# Altium schematic sheet Sheet2.SchDoc
size A3; SheetNumber: 3; SheetTotal: 3
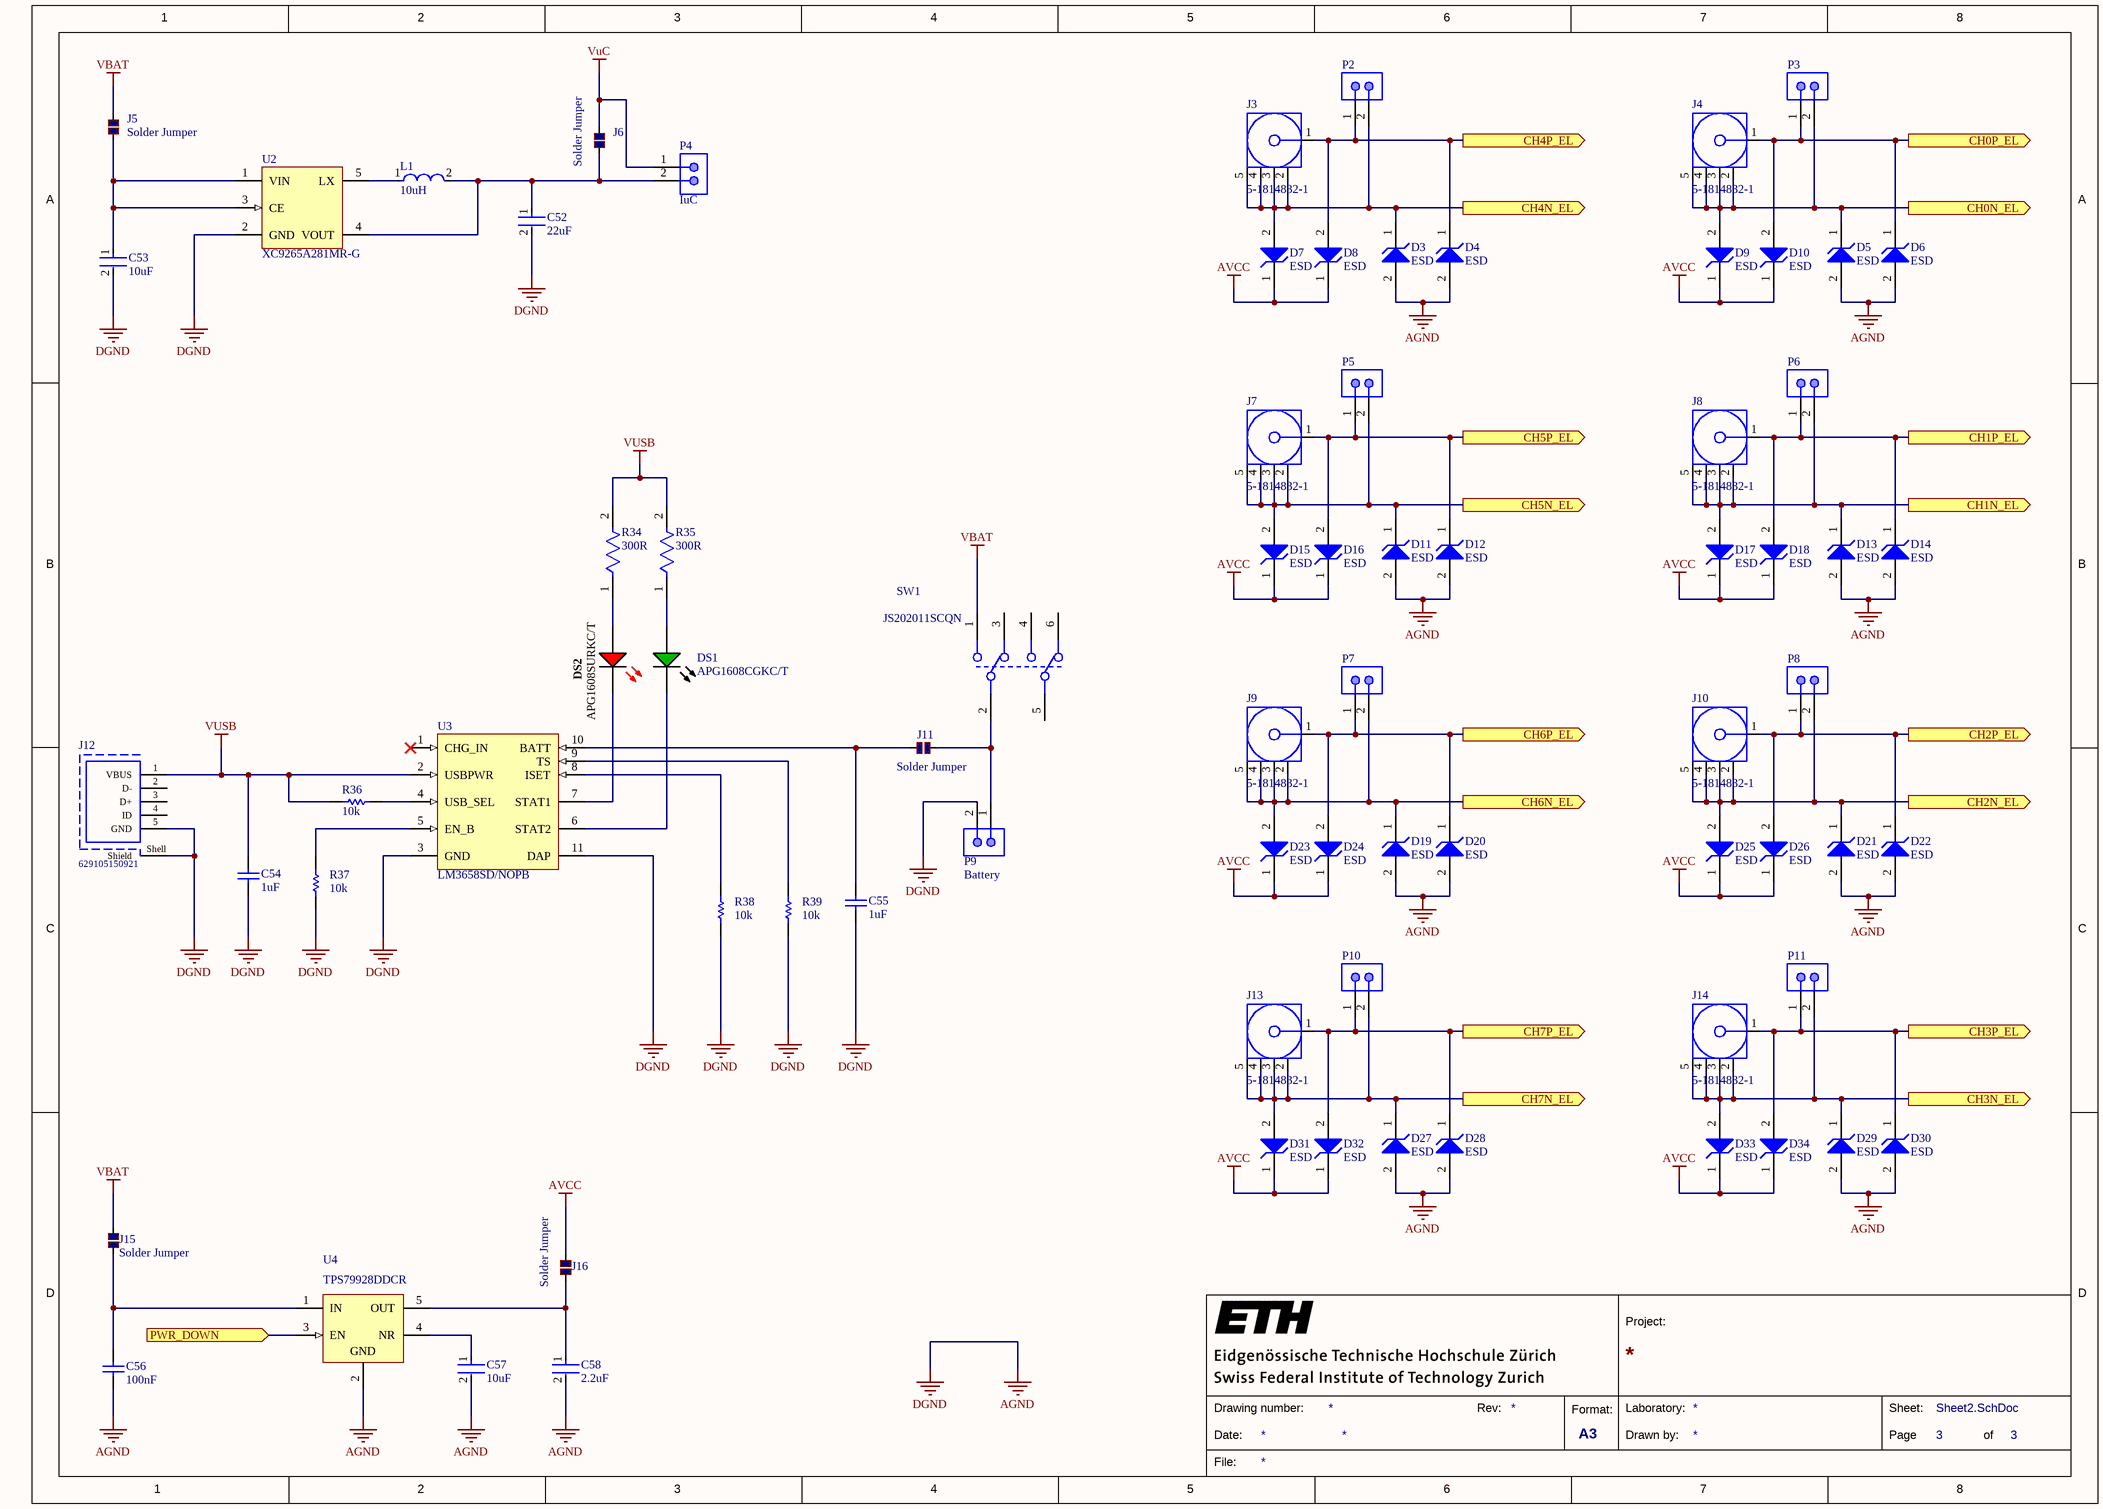
[diagram p0: Sheet2.SchDoc]

## Parts
C52  22uF  [FP-CL10-IPC_A]
C53  10uF  [FP-GRM188-0_1-e0_2_0_55-IPC_B]
C54  1uF  [CAPC1608X95X40ML15T15]
C55  1uF  [CAPC1608X95X40ML15T15]
C56  100nF  [CAPC1608X92X38LL15T08]
C57  10uF  [FP-GRM188-0_1-e0_2_0_55-IPC_B]
C58  2.2uF  [FP-GRM188-0_1-e0_2_0_5-IPC_C]
D3  ESD  [DFN110P160X55-2N]
D4  ESD  [DFN110P160X55-2N]
D5  ESD  [DFN110P160X55-2N]
D6  ESD  [DFN110P160X55-2N]
D7  ESD  [DFN110P160X55-2N]
D8  ESD  [DFN110P160X55-2N]
D9  ESD  [DFN110P160X55-2N]
D10  ESD  [DFN110P160X55-2N]
D11  ESD  [DFN110P160X55-2N]
D12  ESD  [DFN110P160X55-2N]
D13  ESD  [DFN110P160X55-2N]
D14  ESD  [DFN110P160X55-2N]
D15  ESD  [DFN110P160X55-2N]
D16  ESD  [DFN110P160X55-2N]
D17  ESD  [DFN110P160X55-2N]
D18  ESD  [DFN110P160X55-2N]
D19  ESD  [DFN110P160X55-2N]
D20  ESD  [DFN110P160X55-2N]
D21  ESD  [DFN110P160X55-2N]
D22  ESD  [DFN110P160X55-2N]
D23  ESD  [DFN110P160X55-2N]
D24  ESD  [DFN110P160X55-2N]
D25  ESD  [DFN110P160X55-2N]
D26  ESD  [DFN110P160X55-2N]
D27  ESD  [DFN110P160X55-2N]
D28  ESD  [DFN110P160X55-2N]
D29  ESD  [DFN110P160X55-2N]
D30  ESD  [DFN110P160X55-2N]
D31  ESD  [DFN110P160X55-2N]
D32  ESD  [DFN110P160X55-2N]
D33  ESD  [DFN110P160X55-2N]
D34  ESD  [DFN110P160X55-2N]
DS1  APG1608CGKC/T  [KING-LED0603-25-GREEN_V]
DS2  APG1608SURKC/T  [KING-LED0603-25-RED_V]
J3  5-1814832-1  [TECO-5-1814832-1_V]
J4  5-1814832-1  [TECO-5-1814832-1_V]
J5  Solder Jumper  [Small Solder Jumper]
J6  Solder Jumper  [Small Solder Jumper]
J7  5-1814832-1  [TECO-5-1814832-1_V]
J8  5-1814832-1  [TECO-5-1814832-1_V]
J9  5-1814832-1  [TECO-5-1814832-1_V]
J10  5-1814832-1  [TECO-5-1814832-1_V]
J11  Solder Jumper  [Small Solder Jumper]
J12  629105150921  [629105150921]
J13  5-1814832-1  [TECO-5-1814832-1_V]
J14  5-1814832-1  [TECO-5-1814832-1_V]
J15  Solder Jumper  [Small Solder Jumper]
J16  Solder Jumper  [Small Solder Jumper]
L1  10uH  [FP-LQH43CN_03-MFG]
P2  FIX_RLD  [SMTC-TSW-102-07-S-S]  (value not drawn)
P3  FIX_RLD  [SMTC-TSW-102-07-S-S]  (value not drawn)
P4  IuC  [SMTC-TSW-102-07-S-S]
P5  FIX_RLD  [SMTC-TSW-102-07-S-S]  (value not drawn)
P6  FIX_RLD  [SMTC-TSW-102-07-S-S]  (value not drawn)
P7  FIX_RLD  [SMTC-TSW-102-07-S-S]  (value not drawn)
P8  FIX_RLD  [SMTC-TSW-102-07-S-S]  (value not drawn)
P9  Battery  [SMTC-TSW-102-07-S-S]
P10  FIX_RLD  [SMTC-TSW-102-07-S-S]  (value not drawn)
P11  FIX_RLD  [SMTC-TSW-102-07-S-S]  (value not drawn)
R34  300R  [FP-CRCW0603-e3-IPC_A]
R35  300R  [FP-CRCW0603-e3-IPC_A]
R36  10k  [RESC1609X50X30NL8T20]
R37  10k  [RESC1609X50X30NL8T20]
R38  10k  [RESC1609X50X30NL8T20]
R39  10k  [RESC1609X50X30NL8T20]
SW1  JS202011SCQN  [FP-JS202011SCQN-MFG]
U2  XC9265A281MR-G  [Z5+1_N]
U3  LM3658SD/NOPB  [DSC0010A_V]
U4  TPS79928DDCR  [DDC0005A_L]

## Ports
CH0N_EL (out), CH0P_EL (out), CH1N_EL (out), CH1P_EL (out), CH2N_EL (out), CH2P_EL (out), CH3N_EL (out), CH3P_EL (out), CH4N_EL (out), CH4P_EL (out), CH5N_EL (out), CH5P_EL (out), CH6N_EL (out), CH6P_EL (out), CH7N_EL (out), CH7P_EL (out), PWR_DOWN (in)

## Nets
AGND: C52.2 C53.2 C54.1 C55.1 C56.2 C57.2 C58.2 D3.2 D4.2 D5.2 D6.2 D11.2 D12.2 D13.2 D14.2 D19.2 D20.2 D21.2 D22.2 D27.2 D28.2 D29.2 D30.2 J12.5(GND) J12.Shell(Shield) P9.2 R37.1 R38.1 R39.1 U2.2(GND) U3.3(GND) U3.11(DAP) U4.2(GND)  [also labelled DGND]
AVCC: D7.1 D8.1 D9.1 D10.1 D15.1 D16.1 D17.1 D18.1 D23.1 D24.1 D25.1 D26.1 D31.1 D32.1 D33.1 D34.1 J16.2
VBAT: J5.1 J15.2 SW1.1
VuC: J6.1 P4.1
VUSB: C54.2 J12.1(VBUS) R34.2 R35.2 R36.2 U3.2(USBPWR)
CH0N_EL: D5.1 D9.2 J4.2 J4.3 J4.4 J4.5 P3.2 ; port CH0N_EL
CH0P_EL: D6.1 D10.2 J4.1 P3.1 ; port CH0P_EL
CH1N_EL: D13.1 D17.2 J8.2 J8.3 J8.4 J8.5 P6.2 ; port CH1N_EL
CH1P_EL: D14.1 D18.2 J8.1 P6.1 ; port CH1P_EL
CH2N_EL: D21.1 D25.2 J10.2 J10.3 J10.4 J10.5 P8.2 ; port CH2N_EL
CH2P_EL: D22.1 D26.2 J10.1 P8.1 ; port CH2P_EL
CH3N_EL: D29.1 D33.2 J14.2 J14.3 J14.4 J14.5 P11.2 ; port CH3N_EL
CH3P_EL: D30.1 D34.2 J14.1 P11.1 ; port CH3P_EL
CH4N_EL: D3.1 D7.2 J3.2 J3.3 J3.4 J3.5 P2.2 ; port CH4N_EL
CH4P_EL: D4.1 D8.2 J3.1 P2.1 ; port CH4P_EL
CH5N_EL: D11.1 D15.2 J7.2 J7.3 J7.4 J7.5 P5.2 ; port CH5N_EL
CH5P_EL: D12.1 D16.2 J7.1 P5.1 ; port CH5P_EL
CH6N_EL: D19.1 D23.2 J9.2 J9.3 J9.4 J9.5 P7.2 ; port CH6N_EL
CH6P_EL: D20.1 D24.2 J9.1 P7.1 ; port CH6P_EL
CH7N_EL: D27.1 D31.2 J13.2 J13.3 J13.4 J13.5 P10.2 ; port CH7N_EL
CH7P_EL: D28.1 D32.2 J13.1 P10.1 ; port CH7P_EL
PWR_DOWN: U4.3(EN) ; port PWR_DOWN
NetC52_1: C52.1 J6.2 L1.2 P4.2 U2.4(VOUT)
NetC53_1: C53.1 J5.2 U2.1(VIN) U2.3(CE)
NetC55_2: C55.2 J11.2 U3.10(BATT)
NetC56_1: C56.1 J15.1 U4.1(IN)
NetC57_1: C57.1 U4.4(NR)
NetC58_1: C58.1 J16.1 U4.5(OUT)
NetDS1_1: DS1.1(A) R35.1
NetDS1_2: DS1.2(K) U3.6(STAT2)
NetDS2_1: DS2.1(A) R34.1
NetDS2_2: DS2.2(K) U3.7(STAT1)
NetJ11_1: J11.1 P9.1 SW1.2
NetL1_1: L1.1 U2.5(LX)
NetR36_1: R36.1 U3.4(USB_SEL)
NetR37_2: R37.2 U3.5(EN_B)
NetR38_2: R38.2 U3.8(ISET)
NetR39_2: R39.2 U3.9(TS)

Not connected (* = marked no-connect by the designer): J12 2(D-) 3(D+) 4(ID); SW1 3 4 5 6; U3 1(CHG_IN)*

## Notes on the sheet
- 1
- 2
- 3
- 4
- 5
- 6
- 7
- 8
- A
- B
- C
- D
- Project:
- Date:
- Drawing number:
- Rev:
- Format:
- A3
- Drawn by:
- Laboratory:
- Page
- Sheet:
- of
- File:

## Library data of the parts
C52 = CMP-13271-003053-1: Cap Ceramic 22uF 6.3V X5R ±20% Pad SMD 0603 +85°C T/R; Max Operating Temperature: 85°C; Case Code (Imperial): 0603; Packaging: Tape and Reel; Min Operating Temperature: -55°C; Voltage Rating: 6.3V; Case Code (Metric): 1608; Length: 0.063inch; Thickness: 0.041inch; Capacitance: 22uF; Tolerance: 20%; Width: 0.031inch; Mount: Surface Mount; Case/Package: 0603
C53 C57 = CMP-2006-02787-5: Chip Multilayer Ceramic Capacitors for General Purpose, 0603, 10uF, X5R, 15%, 20%, 4V; Case/Package: 0603; Thickness: 0.035inch; Mount: Surface Mount; Capacitance: 10uF; Package Quantity: 4000; Tolerance: 20%; Depth: 0.8mm; Voltage: 4V; Height: 0.8mm; Length: 1.6mm; Packaging: Tape and Reel; Case Code (Imperial): 0603; Voltage Rating: 4V; Radiation Hardening: No; Dielectric: X5R; Max Operating Temperature: 85°C; Voltage Rating (DC): 4V; Min Operating Temperature: -55°C; Termination: SMD/SMT; Width: 0.8mm; Case Code (Metric): 1608; Lead Free: Lead Free
C54 C55 = CMP-1035-02735-2: Manufacturer: Vitramon; Part Number: VJ0603V105ZXQCW1BC
C56 = CMP-1035-02583-2: Manufacturer: Vitramon; Part Number: VJ0603Y104JXJAC
C58 = CMP-2006-02548-2: Chip Multilayer Ceramic Capacitors for General Purpose, 0603, 2.2uF, X5R, 15%, 10%, 35V; REACH SVHC: No SVHC; Weight: 0.000222oz; Thickness: 0.035inch; Height: 0.8mm; Voltage Rating: 35V; Lead Free: Lead Free; Mount: Surface Mount; Material: Ceramic; Package Quantity: 4000; Capacitance: 2.2uF; Length: 1.6mm; Packaging: Tape and Reel; Case/Package: 0603; Min Operating Temperature: -55°C; Case Code (Metric): 1608; Voltage: 35V; Tolerance: 10%; Max Operating Temperature: 85°C; Depth: 0.8mm; Width: 0.8mm; Case Code (Imperial): 0603; Voltage Rating (DC): 35V; Termination: SMD/SMT; Dielectric: X5R
D3-D34 = CMP-01186-1: TVS DIODE 5V 10.9V 2DFN; Power Line Protection: No; Number of Unidirectional Channels: 1; Peak Pulse Current: 70A; Min Operating Temperature: -40°C; Reverse Standoff Voltage: 5V; Case Code (Imperial): 0603; Case Code (Metric): 1610; Clamping Voltage: 10.9V; Packaging: Tape and Reel; Composition: Zener; Max Operating Temperature: 125°C; Case/Package: 0603; Mount: Surface Mount
DS1 = CMP-0239-00001-1: LED, SMT, 0603(1608), 0.25mm Thickness, Green; Forward Current: 30 mA; Reverse Voltage: 5 V; Power Dissipation: 78 mW; Packing: Reel; ComponentLink1Description: Manufacturer URL; ComponentLink1URL: http://www.kingbrightusa.com/; ComponentLink2URL: http://www.kingbrightusa.com/images/catalog/SPEC/APG1608CGKC-T.pdf; Mounting Technology: Surface Mount; Storage Temperature: -40 to 85 degC; DatasheetVersion: Rev. 5B, 10/2012; PartNumber: APG1608CGKC/T; PackageReference: LED0603-25-GREEN; ComponentLink2Description: Datasheet; PackageDescription: 2-Pin SMT LED, 1.6 x 0.8 mm Body, 0.25mm Thickness; PackageVersion: Rev. 5B, 10/2012
DS2 = CMP-0404-00004-1: Ultra Thin Hyper Red SMD Chip LED Lamp, 2 to 2.5 V, -40 to 85 degC, Body 1.6 x 0.8 mm, 0.28 mm Thickness, RoHS, Tape and Reel; Manufacturer: Kingbright; Dice: Hyper Red (AlGaInP); IR (Max): 10 uA; Luminous Intensity mcd @ 20 mA (Min.): 55; Lens Type: Water Clear; Viewing Angle: 120; Luminous Intensity mcd @ 20 mA (Typ.): 110; ComponentLink2Description: Datasheet; ComponentLink3URL: http://www.kingbrightusa.com/images/catalog/SPEC/APG1608SURKC-T.pdf; Packing: Tape and Reel; Mounting Technology: Surface Mount; PackageVersion: Rev. V.5A; ComponentLink1Description: Manufacturer URL; ComponentLink2URL: http://www.kingbrightusa.com/images/catalog/SPEC/APG1608SURKC-T.pdf; ComponentLink3Description: Package Specification; PackageDescription: 2-Pin SMT, Body 1.6 x 0.8 mm, 0.28mm Thickness, Red; PackageReference: LED0603-25-RED; DatasheetVersion: Rev. V.5A; Operating Temperature: -40 to 85 degC; PartNumber: APG1608SURKC/T; ComponentLink1URL: http://www.kingbrightusa.com/; Forward Voltage: 2 to 2.5 V; RoHS: TRUE
J3 J4 J7-J10 J13 J14 = CMP-2000-05415-1: SMA Connector, Pitch 5.08 mm, 1 Position, Height 9.5 mm, Tail Length 4 mm, -65 to 165 degC, RoHS, Bulk; Manufacturer: TE Connectivity; Connector Mounting: PCBMount; Connector Body Style: StraightJack; Impedance: 50ohm; Coaxial Termination: Solder; SVHC: NoSVHC(15-Jun-2015); Frequency Max: 3GHz; Product Range: ZDCSeries; Connector Type: SMACoaxial; Datasheet Version: Rev. B1, 03/2011; Package Reference: 5-1814832-1; Package Description: SMA Connector, Pitch 5.08 mm, 1 Position, Height 9.5 mm, Tail Length 4 mm; Contact Plating: GoldPlatedContacts; Coaxial Cable Types: -; Contact Material: BerylliumCopper; Manufacturer URL: http://www.te.com/; Datasheet URL: http://www.onlinecomponents.com/productFiles/mf-AMP/eng_cd_1814832_a.pdf
J5 J6 J11 J15 J16 = CMP-00005-5: Value: 1; Technology: SMT
J12 = CMP-1502-03249-1: Micro USB 2.0 Type AB Receptacle WR-COM, Horizontal, SMT; Manufacturer: Wurth Elektronik; Rated Current: 1.8A; Contact Resistance: 30mOhm; Working Voltage: 30VAC; Publisher: WurthElektronik; Part Number: 629105150921; Operating Temperature: -40to85degC; Gender: Receptacle; Packaging: TapeandReel; Connector Type: MicroUSB2.0TypeAB; Datasheet URL: https://katalog.we-online.de/em/datasheet/629105150921.pdf; Mounting Technology: SMT; Orientation: Horizontal; Package Reference: 629105150921; Manufacturer URL: http://www.we-online.de
L1 = CMP-06042-001365-1: Wire Wound Ferrite Inductor for Power Lines 10μH ±20% 0.1764Ω 1170mA 1812; Test Frequency: 1MHz; Shielding: Shielded; DC Resistance (DCR): 147mR; Current Rating: 1.17A; Self Resonant Frequency: 20MHz; Saturation Current: 1.05A; Height - Seated (Max): 0.11inch; Case Code (Imperial): 1812; Packaging: Cut Tape; Package Quantity: 500; Mount: Surface Mount; Resistor Type: Wirewound; Depth: 3.2mm; Inductance: 10uH; Min Operating Temperature: -40°C; Core Material: Ferrite; Lead Free: Lead Free; Tolerance: 20%; Height: 2.6mm; Length: 0.177inch; Case Code (Metric): 4532; Max DC Current: 1.17A; Case/Package: 1812; Width: 0.126inch; Max Operating Temperature: 85°C; REACH SVHC: No SVHC; Inductance Tolerance: 20%
P2-P11 = CMP-1681-00004-4: Male Header, Pitch 2.54 mm, 1 x 2 Position, Height 8.38 mm, Tail Length 2.54 mm, -55 to 125 degC, RoHS, Bulk; Manufacturer: Samtec; Rows: 1; ComponentLink1URL: http://www.samtec.com/; Contact Finish: Gold; Mounting Technology: Through Hole; PackageReference: TSW-102-07-S-S; RoHSCompliant: true; Pins: 2; Contact Material: Bronze; ComponentLink2Description: Datasheet; Max Operating Temperature: 125 degC; Min Operating Temperature: -55 degC; Height: 8.38 mm; Packaging: Bulk; ComponentLink1Description: Manufacturer URL; PackageDescription: Male Header, Pitch 2.54 mm, 1 x 2 Position, Height 8.38 mm, Tail Length 2.54 mm; Colour: Black; Contact Plating: Gold; Length: 5.08 mm; ComponentLink2URL: http://suddendocs.samtec.com/catalog_english/tsw_th.pdf; DatasheetVersion: 12/2015; Mount: Through Hole; Lead Pitch: 0.1 inch; REACH SVHC: No SVHC; Package Quantity: 1
R34 R35 = CMP-2000-03216-2: RES Thick Film, 300Ω, 1%, 0.1W, 100ppm/°C, 0603; Voltage Rating (DC): 75V; Power Rating: 100mW; Length: 1.55mm; Height: 0.45mm; Case/Package: 0603; Temperature Coefficient: 100ppm/°C; Packaging: Tape and Reel; Termination: SMD/SMT; Depth: 0.85mm; Max Operating Temperature: 155°C; Radiation Hardening: No; Tolerance: 1%; Lead Free: Lead Free; Case Code (Metric): 1608; Voltage Rating: 75V; Weight: 7.1E-05oz; Package Quantity: 10; Military Standard: Not; Case Code (Imperial): 0603; Resistance: 300R; Composition: Thick Film; Min Operating Temperature: -55°C; Width: 0.033inch; Number of Terminations: 2; Mount: Surface Mount; Features: Automotive AEC-Q200; Contact Plating: Tin; Max Power Dissipation: 100mW
R36-R39 = CMP-1666-00005-4: Chip Resistor, 10 KOhm, +/- 1%, 100 mW, -55 to 155 degC, 0603 (1608 Metric), RoHS, Tape and Reel; Manufacturer: Vishay Semiconductor; Voltage Rating: 75 V; Max Operating Temperature: 155 degC; PackageDescription: 2-Pin Surface Mount Device, Body 1.575 x 0.85 mm; ComponentLink1Description: Manufacturer URL; RoHSCompliant: true; PackageReference: 0603; REACH SVHC: Unknown; Length: 1.55 mm; DatasheetVersion: 06/2012; Packaging: Tape and Reel; Min Operating Temperature: -55 degC; Mounting Technology: Surface Mount; ComponentLink2URL: https://datasheet.ciiva.com/11809/0900766b80d98afc-11809037.pdf; Height: 0.45 mm; ComponentLink2Description: Datasheet; Package Quantity: 5000; ComponentLink1URL: http://www.vishay.com/
SW1 = CMP-2000-05087-2: SWITCH SLIDE DPDT 300MA 6V; Actuator Material: Nylon; Actuator Length: 2mm; Actuator Type: Standard; Contact Resistance: 70mR; Switch Function: On-On; Electrical Life: 5000Cycles; Voltage Rating (DC): 6V; Contact Current Rating: 300mA; Contact Plating: Silver; Throw Configuration: DPDT; REACH SVHC: No SVHC; Length: 9mm; Package Quantity: 1; Min Operating Temperature: -20°C; Contact Material: Copper Alloy; Switch Travel: 2mm; Radiation Hardening: No; Depth: 7.5mm; Packaging: Tape and Reel; Max Voltage Rating (DC): 6V; Housing Material: Nylon; Max Operating Temperature: 85°C; Current Rating: 300mA; Orientation: Vertical; Termination: Gull Wing; Flammability Rating: UL94 V-2; Lead Free: Lead Free; Mount: Surface Mount; Max Current Rating: 300mA
U2 = CMP-01269-1: IC REG BUCK 1.8V 0.2A SYNC SOT25; Synchronous Rectifier: Yes; Max Input Voltage: 6V; Min Input Voltage: 2V; Number of Outputs: 1; Output Type: Fixed; Output Current: 200mA; Output Configuration: Positive; Case/Package: SOT-25-5; Min Operating Temperature: -40°C; Min Output Voltage: 1.8V; Mount: Surface Mount; Packaging: Tape and Reel; Max Operating Temperature: 85°C
U3 = CMP-0063-00780-3: Dual Source USB/AC Li Chemistry Charger IC for Portable Applications, 10-pin LLP, Pb-Free; Manufacturer: Texas Instruments; PackageTopMarking: ZXYTT*L111B; CompType: MiscPower; PowerWise: N; PackageDescription: LLP, Plastic, Dual, 3 x 3 x 0.8mm Body, 10 Lead, 0.5mm Pitch, No Pullback; ComponentLink1Description: Datasheet URL; ComponentLink1URL: http://www.ti.com/general/docs/lit/getliterature.tsp?genericPartNumber=LM3658&fileType=pdf; PinCount: 10; RoHS: Y; PackageReference: DSC0010A
U4 = CMP-0394-01068-2: Single Output High PSRR LDO, 200 mA, Fixed 2.8 V Output, 2.7 to 6.5 V Input, with Low IQ, 5-pin SOT (DDC), -40 to 85 degC, Green (RoHS & no Sb/Br); Manufacturer: Texas Instruments; Vout Adj(Max)(V): 2.8; SubFamily: Single Channel LDO; Vin(Min)(V): 2.7; Iq(Typ)(mA): 0.04; Rating: Catalog; Vin(Max)(V): 6.5; Accuracy(%): 2; Vdo(Typ)(mV): 100; Iout(Max)(A): 0.2; Mounting Technology: Surface Mount; ComponentLink2Description: Datasheet; PartNumber: TPS79928DDCR; PackageReference: DDC0005A; PackageDescription: 5-Pin Plastic Small Outline, Body 2.9 x 1.6 mm, 0.95 mm Pitch; DatasheetVersion: SBVS056J; Vout Adj(Min)(V): 2.8; ComponentLink3URL: http://www.ti.com/litv/pdf/mpds123d; ComponentLink2URL: http://www.ti.com/general/docs/lit/getliterature.tsp?genericPartNumber=TPS79928&fileType=pdf; Code_JEDEC: MO-193; ComponentLink3Description: Package Specification; Fixed Output Options(V): 2.8; ComponentLink1Description: Manufacturer URL; Eco-Plan: Green (RoHS & no Sb/Br); PackageVersion: 4204403-2/E; ComponentLink1URL: http://www.ti.com/